# EAGLE design gs-breakout-breakout (EAGLE 6.5.0)
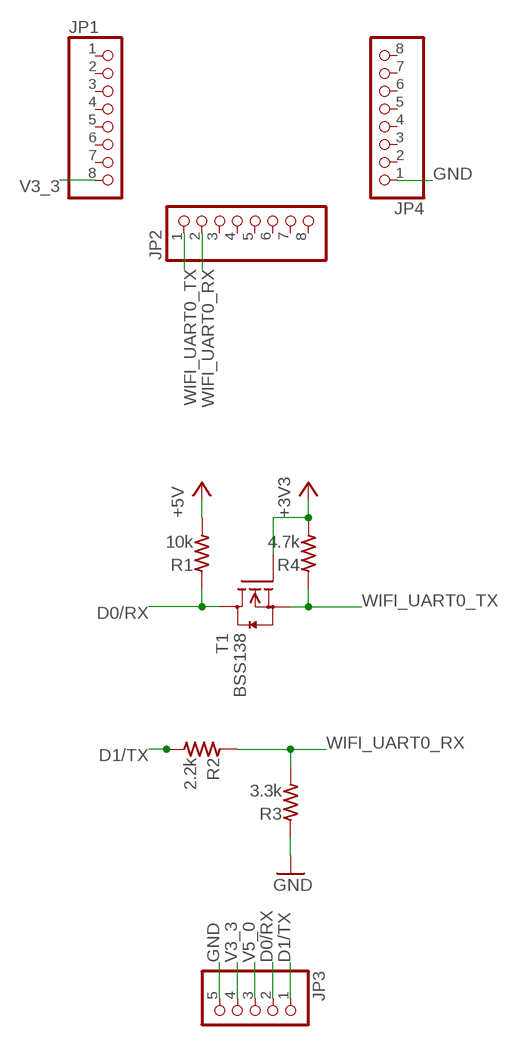
[diagram p0: schematic, sheet 1]

## Parts
JP1  PINHD-1X8  [1X08]
JP2  PINHD-1X8  [1X08]
JP3  PINHD-1X5  [1X05]
JP4  PINHD-1X8  [1X08]
R1  10k  RESISTOR-US2012  [SMD2012]
R2  2.2k  RESISTOR-US2012  [SMD2012]
R3  3.3k  RESISTOR-US2012  [SMD2012]
R4  4.7k  RESISTOR-US2012  [SMD2012]
T1  BSS138  [SOT23]

## Nets
+3V3 [3.3v]: R4.2 T1.1(G)
+5V [power]: R1.2
D0/RX: JP3.2 R1.1 T1.3(D)
D1/TX: JP3.1 R2.2
GND [gnd]: JP3.5 JP4.1 R3.1
V3_3: JP1.8 JP3.4
V5_0: JP3.3
WIFI_UART0_RX: JP2.2 R2.1 R3.2
WIFI_UART0_TX: JP2.1 R4.1 T1.2(S)
Unconnected: JP1.1 JP1.2 JP1.3 JP1.4 JP1.5 JP1.6 JP1.7 JP2.3 JP2.4 JP2.5 JP2.6 JP2.7 JP2.8 JP4.2 JP4.3 JP4.4 JP4.5 JP4.6 JP4.7 JP4.8

## Library data of the parts
JP1 JP2 JP4 = pinhead:PINHD-1X8: PIN HEADER
JP3 = pinhead:PINHD-1X5: PIN HEADER
R1-R4 = my:RESISTOR-US: Generic Registor
T1 = m-pad-2.1:BSS138: Fairchild Semiconductors BSS138 N-Channel Logic Level Enhancement Mode Field Effect Transistor General Description: These N-Channel enhancement mode field effect transistors are produced using Fairchild's proprietary, high cell density, DMOS technology. These products have been designed to minimize on-state resistance while provide rugged, reliable, and fast switching performance.These products are particularly suited for low voltage, low current applications such as small servo motor control, power MOSFET gate drivers, and other switching applications. Features: 0.22 A, 50 V. RDS(ON) = 3.5Ohm @ VGS = 10 V RDS(ON) = 6.0Ohm @ VGS = 4.5 V High density cell design for extremely low RDS(ON) Rugged and Reliable Compact industry standard SOT-23 surface mount package Please send any comments to: messi@users.sourceforge.net

## Net classes
0 default: width 0.254 mm
1 power: width 0.406 mm
3 gnd: width 0.406 mm
4 3.3v: width 0.406 mm

## Board
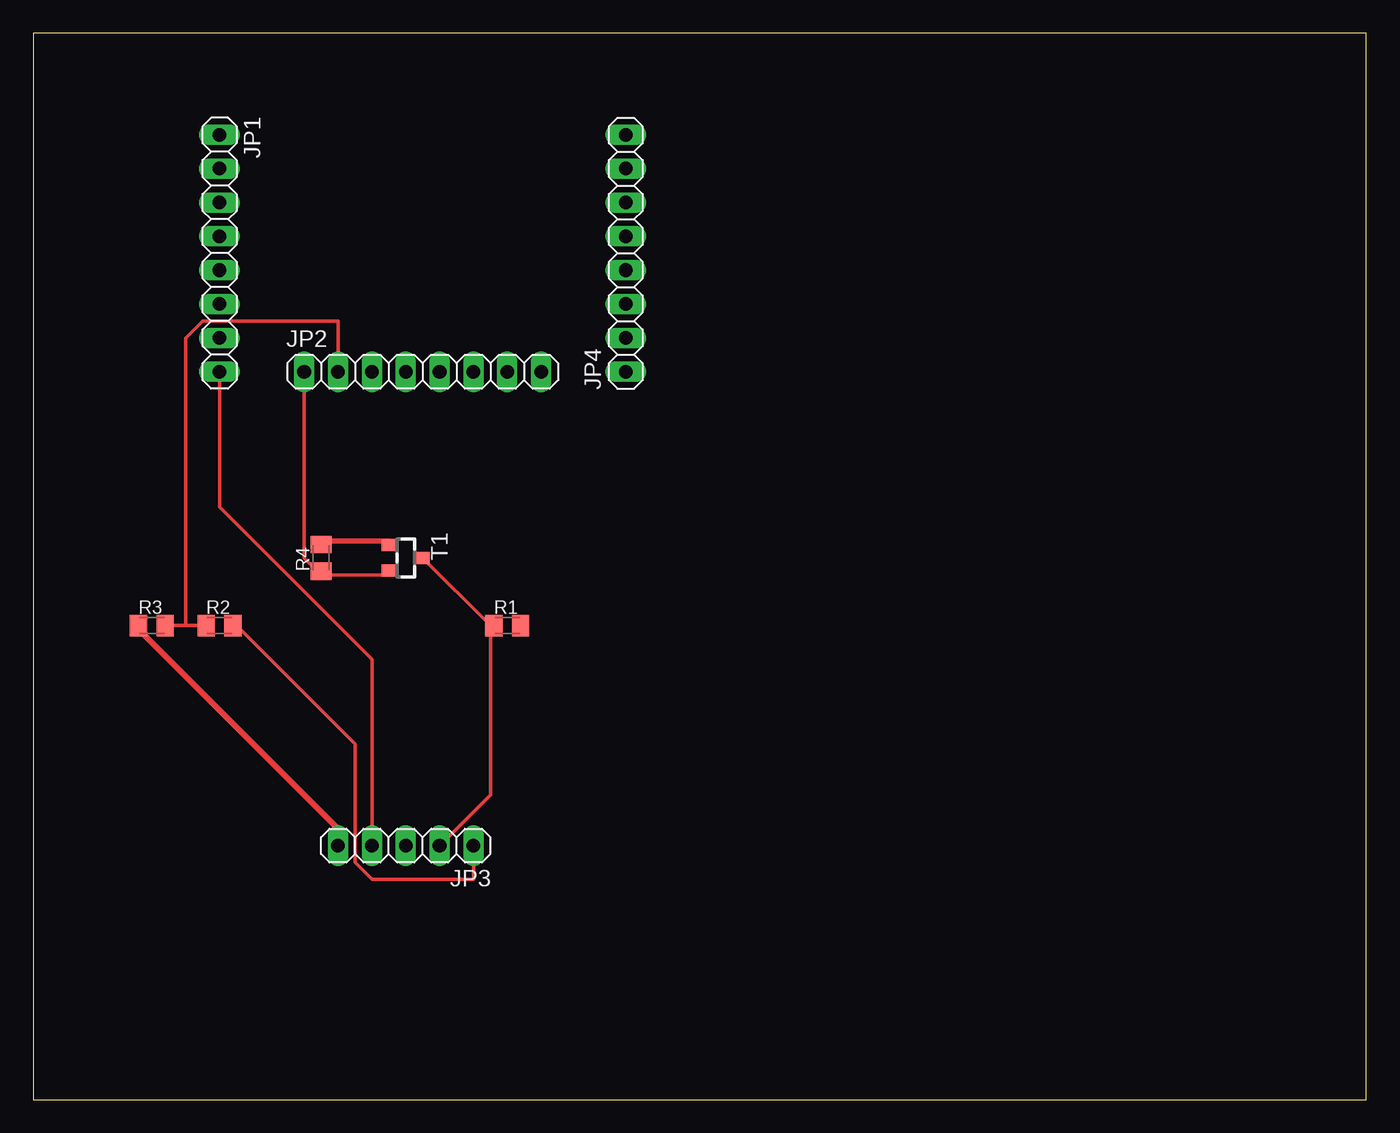
[diagram p1: board, top side]
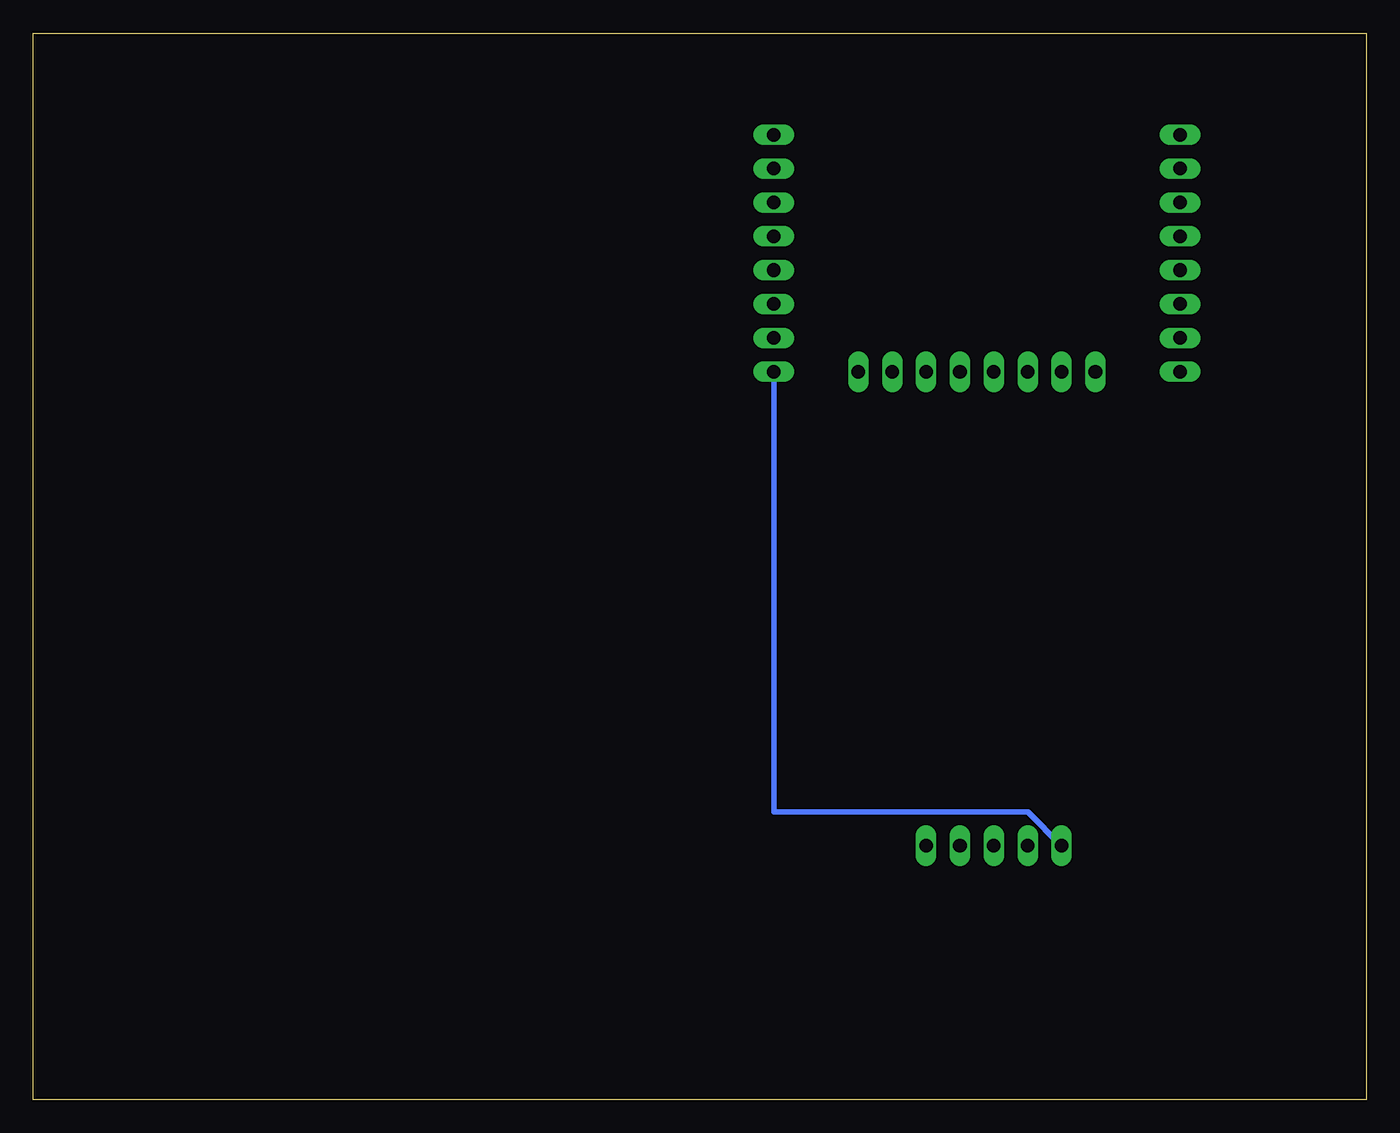
[diagram p2: board, bottom side, seen from below]

Size 100 x 80 mm. Coordinates in mm from the lower left corner, seen from the top.
Outline: 0,0 100,0 100,80 0,80 0,0
Copper layers (1*16): Top 0.035mm / dielectric 1.5mm / Bottom 0.035mm
Design rules "default": minimum track width 10mil, minimum drill 24mil, track to track 8mil, track to pad 8mil, pad to pad 8mil, via to via 8mil, smd to smd 8mil, copper to edge 40mil, drill to drill 8mil, minimum pad ring 10mil, minimum via ring 8mil, stop-mask expansion 4mil, vias tented up to drill 0mil, thermal gap 10mil

### Footprints (pad centres in the part's own frame; a part is rotated, then mirrored left to right if it is on the bottom)
1X08 = drill 1.016 long: 1 -8.89,0; 2 -6.35,0; 3 -3.81,0; 4 -1.27,0; 5 1.27,0; 6 3.81,0; 7 6.35,0; 8 8.89,0
1X05 = drill 1.016 long: 1 -5.08,0; 2 -2.54,0; 3 0,0; 4 2.54,0; 5 5.08,0
SMD2012 = smd 1.3 x 1.6: 1 -1,0; 2 1,0
SOT23 = smd 0.9 x 1.2: 1 -0.95,-1.2; 2 0.95,-1.2; 3 0,1.2

### Placement (x,y rotation side)
JP1  13.97,63.5 270 top
JP2  29.21,54.61 0 top
JP3  27.94,19.05 180 top
JP4  44.45,63.5 90 top
R1  35.56,35.56 0 top
R2  13.97,35.56 0 top
R3  8.89,35.56 0 top
R4  21.59,40.64 90 top
T1  27.94,40.64 270 top

### Tracks (layer width: path | path; a pad name or v marks a point on that pad's centre or on a via)
+3V3
  Top 0.406: T1.1 26.67,41.91 21.59,41.91 R4.2
D0/RX
  Top 0.254: 34.29,35.56 29.21,40.64 T1.3 | 34.29,35.56 R1.1 34.29,35.56 | JP3.2 34.29,22.86 34.29,35.56
D1/TX
  Top 0.254: JP3.1 33.02,16.51 25.4,16.51 24.13,17.78 24.13,26.67 15.24,35.56 R2.2
GND
  Top 0.406: JP3.5 22.86,20.32 7.62,35.56 R3.1
  Bottom 0.406: JP4.1 44.45,21.59 25.4,21.59 JP3.5
V3_3
  Top 0.254: JP3.4 25.4,33.02 13.97,44.45 JP1.8
WIFI_UART0_RX
  Top 0.254: 11.43,35.56 12.7,35.56 R2.1 | 11.43,35.56 10.16,35.56 R3.2 | 11.43,35.56 11.43,57.15 12.7,58.42 22.86,58.42 JP2.2
WIFI_UART0_TX
  Top 0.254: 21.59,39.37 26.67,39.37 T1.2 | 21.59,39.37 R4.1 21.59,39.37 | JP2.1 20.32,40.64 21.59,39.37